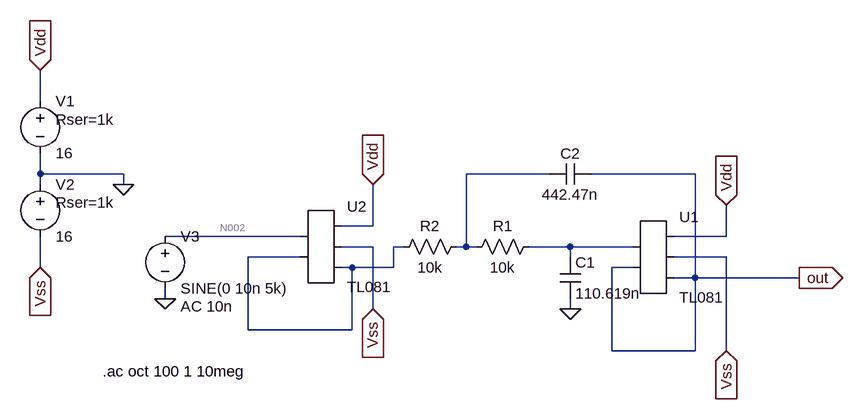
[diagram p0: schematic Draft9.asc]
* Draft9.asc
* U1: TL081 (symbol AutoGenerated\TL081 not available, pins judged from their places): pin1=N004 pin2=out pin3=Vdd pin4=Vss pin5=out
R1 N004 N001 10k tol=5 pwr=0.25
R2 N001 N003 10k tol=5 pwr=0.25
C1 N004 0 110.619n V=50 Rser=0.1
C2 out N001 442.47n V=50 Rser=0.1
V1 Vdd 0 16 Rser=1k
V2 0 Vss 16 Rser=1k
V3 N002 0 SINE(0 10n 5k) AC 10n
* U2: TL081 (symbol AutoGenerated\TL081 not available, pins judged from their places): pin1=N002 pin2=N003 pin3=Vdd pin4=Vss pin5=N003
.ac oct 100 1 10meg
.backanno
.end

* Results of the author's LTspice run, read from the files saved beside the schematic
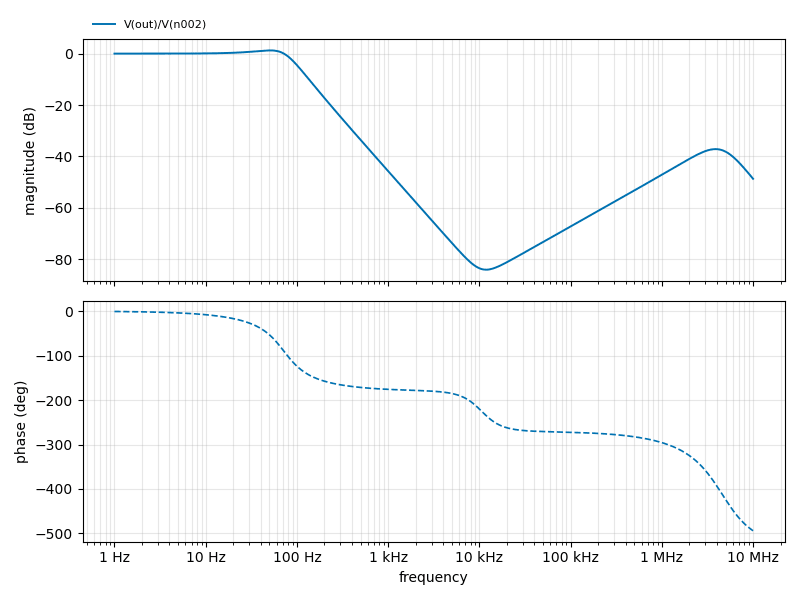
[diagram p1: AC Analysis of Draft9.asc, plotted from the saved traces]
* AC Analysis, 1 run:
*   V(out)/V(n002): 0.00 dB at 1 Hz, -48.67 dB at 10 MHz, peak 1.25 dB at 50.91 Hz, 3 dB below the peak at 84.08 Hz